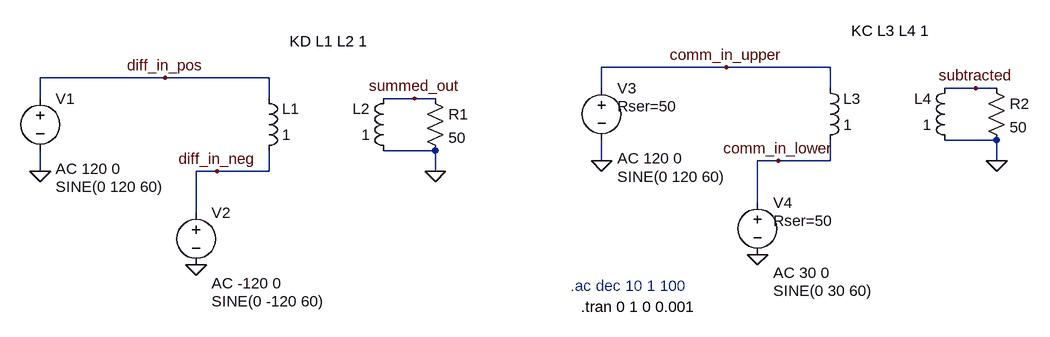
[diagram p0: schematic balun.asc]
balun.asc, the LTspice schematic file:
Version 4.1
SHEET 1 1644 680
WIRE 1168 160 976 160
WIRE 1328 160 1168 160
WIRE 304 176 112 176
WIRE 464 176 304 176
WIRE 976 192 976 160
WIRE 1328 192 1328 160
WIRE 1552 192 1504 192
WIRE 1584 192 1552 192
WIRE 112 208 112 176
WIRE 464 208 464 176
WIRE 688 208 640 208
WIRE 720 208 688 208
WIRE 1584 272 1504 272
WIRE 720 288 640 288
WIRE 976 304 976 272
WIRE 1248 304 1216 304
WIRE 1328 304 1328 272
WIRE 1328 304 1248 304
WIRE 1584 304 1584 272
WIRE 112 320 112 288
WIRE 384 320 352 320
WIRE 464 320 464 288
WIRE 464 320 384 320
WIRE 720 320 720 288
WIRE 1216 368 1216 304
WIRE 352 384 352 320
FLAG 720 320 0
FLAG 352 464 0
FLAG 112 320 0
FLAG 304 176 diff_in_pos
FLAG 384 320 diff_in_neg
FLAG 688 208 summed_out
FLAG 1584 304 0
FLAG 1216 448 0
FLAG 976 304 0
FLAG 1168 160 comm_in_upper
FLAG 1248 304 comm_in_lower
FLAG 1552 192 subtracted
SYMBOL voltage 112 192 R0
WINDOW 3 24 152 Left 2
WINDOW 123 24 124 Left 2
WINDOW 39 24 44 Left 2
SYMATTR Value SINE(0 120 60)
SYMATTR Value2 AC 120 0
SYMATTR InstName V1
SYMBOL ind 448 304 M180
WINDOW 0 36 80 Left 2
WINDOW 3 36 40 Left 2
SYMATTR InstName L1
SYMATTR Value 1
SYMATTR Type ind
SYMATTR SpiceLine Rser=1m
SYMBOL ind 656 304 R180
WINDOW 0 36 80 Left 2
WINDOW 3 36 40 Left 2
SYMATTR InstName L2
SYMATTR Value 1
SYMATTR Type ind
SYMATTR SpiceLine Rser=1m
SYMBOL res 704 192 R0
SYMATTR InstName R1
SYMATTR Value 50
SYMBOL voltage 352 368 R0
WINDOW 3 24 152 Left 2
WINDOW 123 24 124 Left 2
WINDOW 39 0 0 Left 0
SYMATTR Value SINE(0 -120 60)
SYMATTR Value2 AC -120 0
SYMATTR InstName V2
SYMBOL voltage 976 176 R0
WINDOW 3 24 152 Left 2
WINDOW 123 24 124 Left 2
WINDOW 39 24 44 Left 2
SYMATTR Value SINE(0 120 60)
SYMATTR Value2 AC 120 0
SYMATTR SpiceLine Rser=50
SYMATTR InstName V3
SYMBOL ind 1312 288 M180
WINDOW 0 36 80 Left 2
WINDOW 3 36 40 Left 2
SYMATTR InstName L3
SYMATTR Value 1
SYMATTR Type ind
SYMATTR SpiceLine Rser=1m
SYMBOL ind 1520 288 R180
WINDOW 0 36 80 Left 2
WINDOW 3 36 40 Left 2
SYMATTR InstName L4
SYMATTR Value 1
SYMATTR Type ind
SYMATTR SpiceLine Rser=1m
SYMBOL res 1568 176 R0
SYMATTR InstName R2
SYMATTR Value 50
SYMBOL voltage 1216 352 R0
WINDOW 3 24 152 Left 2
WINDOW 123 24 124 Left 2
WINDOW 39 24 44 Left 2
SYMATTR Value SINE(0 30 60)
SYMATTR Value2 AC 30 0
SYMATTR SpiceLine Rser=50
SYMATTR InstName V4
TEXT 496 120 Left 2 !KD L1 L2 1
TEXT 944 528 Left 2 !.tran 0 1 0 0.001
TEXT 928 496 Left 2 ;.ac dec 10 1 100
TEXT 1360 104 Left 2 !KC L3 L4 1

The netlist it stands for:
* balun.asc
V1 diff_in_pos 0 SINE(0 120 60) AC 120 0
L1 diff_in_neg diff_in_pos 1 Rser=1m
L2 0 summed_out 1 Rser=1m
R1 summed_out 0 50
V2 diff_in_neg 0 SINE(0 -120 60) AC -120 0
V3 comm_in_upper 0 SINE(0 120 60) AC 120 0 Rser=50
L3 comm_in_lower comm_in_upper 1 Rser=1m
L4 0 subtracted 1 Rser=1m
R2 subtracted 0 50
V4 comm_in_lower 0 SINE(0 30 60) AC 30 0 Rser=50
KD L1 L2 1
.tran 0 1 0 0.001
* .ac dec 10 1 100
KC L3 L4 1
.backanno
.end

* Results of the author's LTspice run, read from the files saved beside the schematic
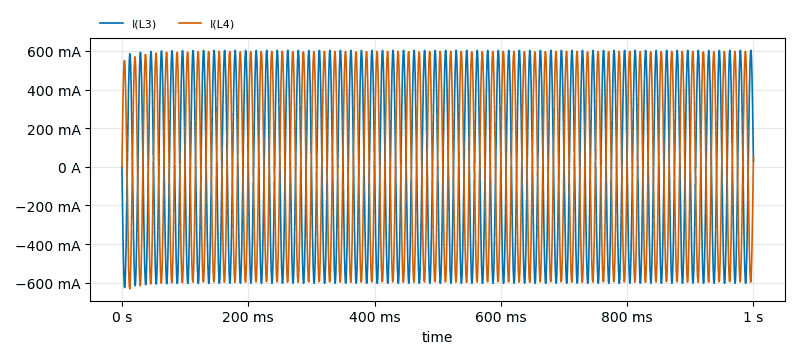
[diagram p1: Transient Analysis of balun.asc, plotted from the saved traces]
* Transient Analysis, 1 run:
*   I(L3): min -625.2 mA, max 602.8 mA, average -785.5 µA, rms 427.5 mA, last 26.08 mA
*   I(L4): min -631.6 mA, max 597.8 mA, average -1.565 mA, rms 423.5 mA, last 52.16 mA